# EAGLE schematic UI PCB - SCHEMATICS (EAGLE 9.7.0)

## Sheet 1 of 3
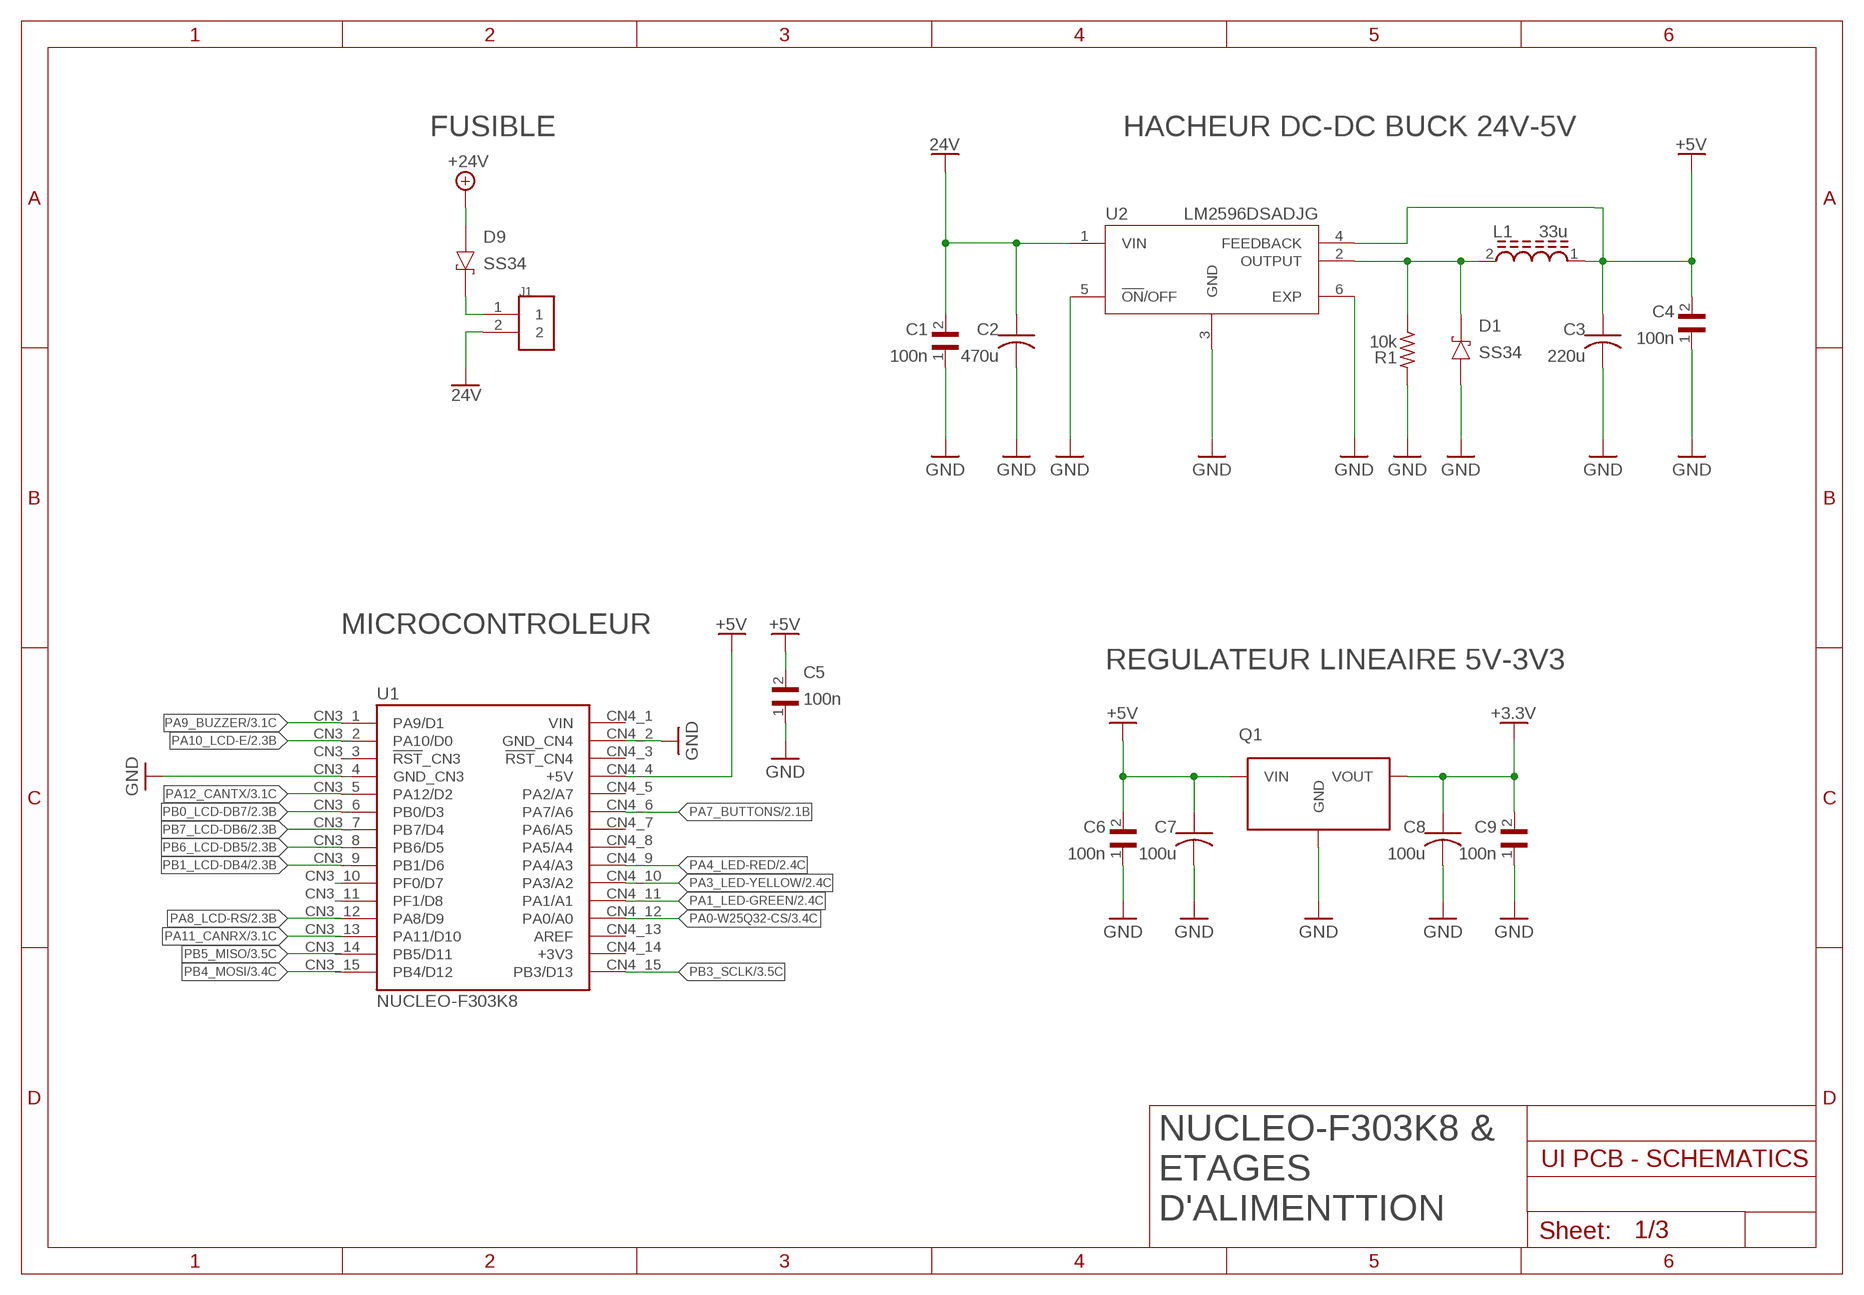
[diagram p0: schematic, sheet 1]

### Parts
C1  SR211C104KARTR1  [CAPRR508W50L508T317H508]
C2  ECA2CHG220  [CAPPRD500W60D1000H2000]
C3  EEUFC1E101SH  [CAPPRD250W50D630H1120]
C4  SR211C104KARTR1  [CAPRR508W50L508T317H508]
C5  SR211C104KARTR1  [CAPRR508W50L508T317H508]
C6  SR211C104KARTR1  [CAPRR508W50L508T317H508]
C7  ECEA1VKS470  [CAPPRD250W45D800H500]
C8  ECEA1VKS470  [CAPPRD250W45D800H500]
C9  SR211C104KARTR1  [CAPRR508W50L508T317H508]
D1  SS34  [DIO_SS34]
D9  SS34  [DIO_SS34]
J1  282837-2  [TE_282837-2]
L1  SRR1260-330M  [INDP125125X600N]
Q1  LD39150DT33-R  [DPAK]
R1  10k  R-US_0204/7  [0204/7]
U1  NUCLEO-F042K6  [MODULE_NUCLEO-F042K6]
U2  LM2596DSADJG  [CONV_LM2596DSADJG]

### Nets
24V: C1.2 C2.P J1.2 U2.1(VIN)
+3.3V: C8.P C9.2 Q1.3(VOUT) ; also sheet 2,3
+5V: C3.P C4.2 C5.2 C6.2 C7.P L1.1 Q1.1(VIN) U1.CN4_4(+5V) U2.4(FEEDBACK) ; also sheet 2,3
+24V: D9.A ; also sheet 3
GND: C1.1 C2.N C3.N C4.1 C5.1 C6.1 C7.N C8.N C9.1 D1.A Q1.2(GND) R1.2 U1.CN3_4(GND_CN3) U1.CN4_2(GND_CN4) U2.3(GND) U2.5(!ON!/OFF) U2.6(EXP) ; also sheet 2,3
N$2: D1.C(K) L1.2 R1.1 U2.2(OUTPUT)
N$13: D9.C(K) J1.1
PA0-W25Q32-CS: U1.CN4_12(PA0/A0) ; also sheet 3
PA1_LED-GREEN: U1.CN4_11(PA1/A1) ; also sheet 2
PA3_LED-YELLOW: U1.CN4_10(PA3/A2) ; also sheet 2
PA4_LED-RED: U1.CN4_9(PA4/A3) ; also sheet 2
PA7_BUTTONS: U1.CN4_6(PA7/A6) ; also sheet 2
PA8_LCD-RS: U1.CN3_12(PA8/D9) ; also sheet 2
PA9_BUZZER: U1.CN3_1(PA9/D1) ; also sheet 3
PA10_LCD-E: U1.CN3_2(PA10/D0) ; also sheet 2
PA11_CANRX: U1.CN3_13(PA11/D10) ; also sheet 3
PA12_CANTX: U1.CN3_5(PA12/D2) ; also sheet 3
PB0_LCD-DB7: U1.CN3_6(PB0/D3) ; also sheet 2
PB1_LCD-DB4: U1.CN3_9(PB1/D6) ; also sheet 2
PB3_SCLK: U1.CN4_15(PB3/D13) ; also sheet 3
PB4_MOSI: U1.CN3_15(PB4/D12) ; also sheet 3
PB5_MISO: U1.CN3_14(PB5/D11) ; also sheet 3
PB6_LCD-DB5: U1.CN3_8(PB6/D5) ; also sheet 2
PB7_LCD-DB6: U1.CN3_7(PB7/D4) ; also sheet 2
Unconnected: U1.CN3_3(!RST!_CN3) U1.CN3_10(PF0/D7) U1.CN3_11(PF1/D8) U1.CN4_3(!RST!_CN4) U1.CN4_5(PA2/A7) U1.CN4_7(PA6/A5) U1.CN4_8(PA5/A4) U1.CN4_13(AREF)

### Notes on the sheet
- FUSIBLE | HACHEUR DC-DC BUCK 24V-5V
- 33u
- 100n
- 100n | 470u | 220u
- MICROCONTROLEUR
- REGULATEUR LINEAIRE 5V-3V3
- 100n
- 100n | 100u | 100u | 100n
- NUCLEO-F303K8
- NUCLEO-F303K8 &
  ETAGES 
  D'ALIMENTTION

## Sheet 2 of 3
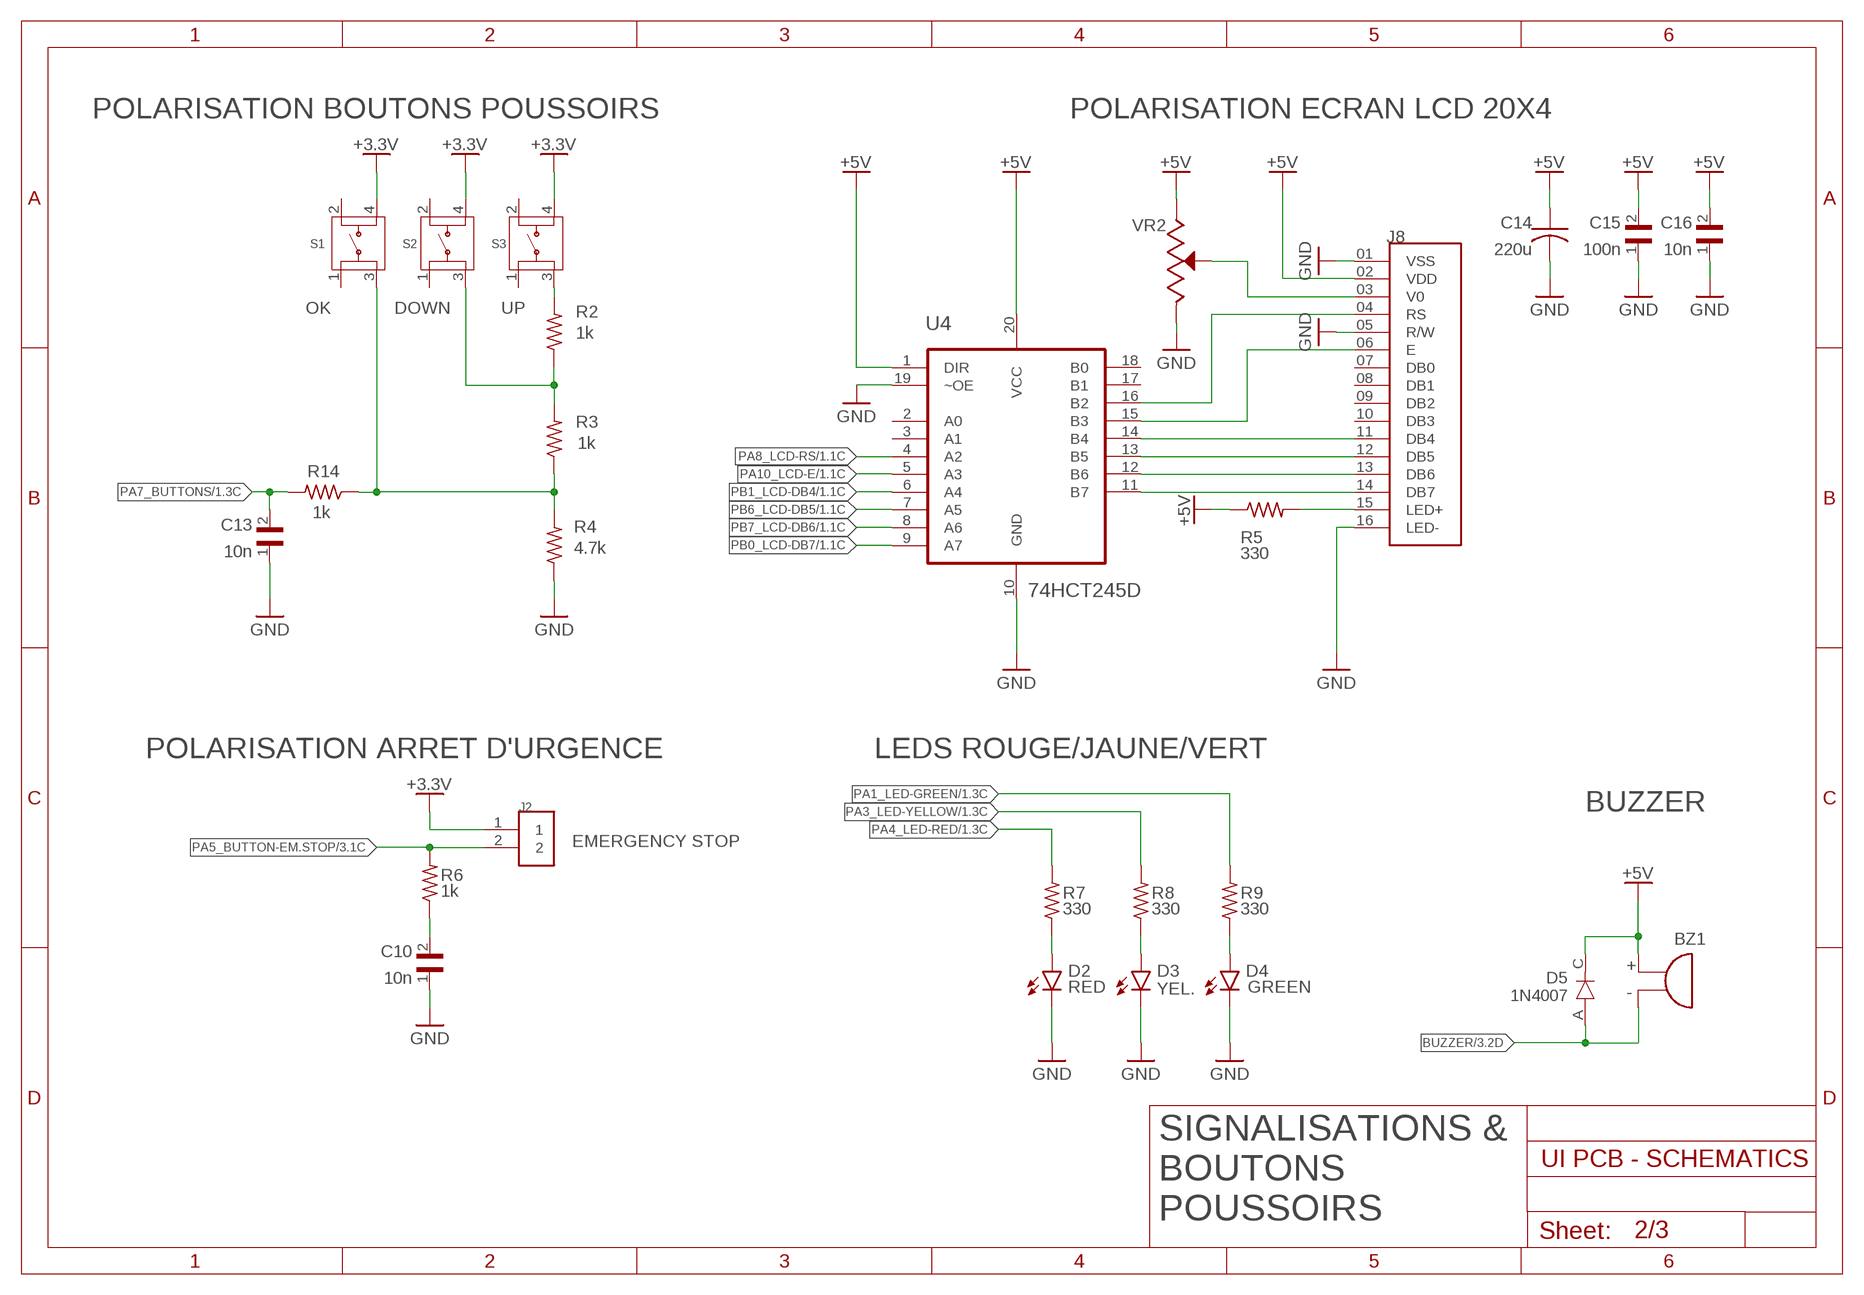
[diagram p1: schematic, sheet 2]

### Parts
BZ1  KSSG1201-16  [XDCR_KSSG1201-16]
C10  SR211C104KARTR1  [CAPRR508W50L508T317H508]
C13  SR211C104KARTR1  [CAPRR508W50L508T317H508]
C14  EEUFC1E101SH  [CAPPRD250W50D630H1120]
C15  SR211C104KARTR1  [CAPRR508W50L508T317H508]
C16  SR211C104KARTR1  [CAPRR508W50L508T317H508]
D2  LED_RADIALRED  [LEDRD254W60D565H860B_R]
D3  LED_RADIALYELLOW  [LEDRD254W60D565H860B_Y]
D4  LED_RADIALWHITE  [LEDRD254W60D565H860B_W]
D5  1N4007  [DIOAD1060W80L520D270]
J2  282837-2  [TE_282837-2]
J8  SSW-116-02-G-S-RA  [SAMTEC_SSW-116-02-G-S-RA]
R2  1k  R-US_0204/7  [0204/7]
R3  1k  R-US_0204/7  [0204/7]
R4  4.7k  R-US_0204/7  [0204/7]
R5  330  R-US_0204/7  [0204/7]
R6  1k  R-US_0204/7  [0204/7]
R7  330  R-US_0204/7  [0204/7]
R8  330  R-US_0204/7  [0204/7]
R9  330  R-US_0204/7  [0204/7]
R14  1k  R-US_0204/7  [0204/7]
S1  FSM8JH  [SW_FSM8JH]
S2  FSM8JH  [SW_FSM8JH]
S3  FSM8JH  [SW_FSM8JH]
U4  74HCT245D  [SOIC127P1032X265-20N]
VR2  3299Y-1-104LF  [3299Y1104LF]

### Nets
+3.3V: J2.1 S1.4 S2.4 S3.4 ; also sheet 1,3
+5V: BZ1.P(POS) C14.P C15.2 C16.2 D5.C J8.02(VDD) R5.1 U4.1(DIR) U4.20(VCC) VR2.1 ; also sheet 1,3
BUZZER: BZ1.N(NEG) D5.A ; also sheet 3
GND: C10.1 C13.1 C14.N C15.1 C16.1 D2.C D3.C D4.C J8.01(VSS) J8.05(R/W) J8.16(LED-) R4.1 U4.10(GND) VR2.3 ; also sheet 1,3
N$1: C10.2 R6.1
N$3: J8.14(DB7) U4.11(B7)
N$4: J8.13(DB6) U4.12(B6)
N$5: J8.12(DB5) U4.13(B5)
N$6: J8.11(DB4) U4.14(B4)
N$7: J8.06(E) U4.15(B3)
N$8: R2.2 S3.3
N$9: J8.04(RS) U4.16(B2)
N$10: R3.1 R4.2 R14.1 S1.3
N$12: R2.1 R3.2 S2.3
N$17: U4.19(~OE) ; supply symbol labelled GND
N$18: J8.03(V0) VR2.2
N$19: J8.15(LED+) R5.2
N$21: D2.A R7.1
N$22: D4.A R9.1
N$23: D3.A R8.1
PA1_LED-GREEN: R9.2 ; also sheet 1
PA3_LED-YELLOW: R8.2 ; also sheet 1
PA4_LED-RED: R7.2 ; also sheet 1
PA5_BUTTON-EM.STOP: J2.2 R6.2 ; also sheet 3
PA7_BUTTONS: C13.2 R14.2 ; also sheet 1
PA8_LCD-RS: U4.4(A2) ; also sheet 1
PA10_LCD-E: U4.5(A3) ; also sheet 1
PB0_LCD-DB7: U4.9(A7) ; also sheet 1
PB1_LCD-DB4: U4.6(A4) ; also sheet 1
PB6_LCD-DB5: U4.7(A5) ; also sheet 1
PB7_LCD-DB6: U4.8(A6) ; also sheet 1
Unconnected: J8.07(DB0) J8.08(DB1) J8.09(DB2) J8.10(DB3) S1.1 S1.2 S2.1 S2.2 S3.1 S3.2 U4.2(A0) U4.3(A1) U4.17(B1) U4.18(B0)

### Notes on the sheet
- POLARISATION BOUTONS POUSSOIRS | POLARISATION ECRAN LCD 20X4
- 220u | 100n | 10n
- OK | DOWN | UP
- 10n
- POLARISATION ARRET D'URGENCE | LEDS ROUGE/JAUNE/VERT
- BUZZER
- EMERGENCY STOP
- 10n
- RED | YEL. | GREEN
- SIGNALISATIONS & 
  BOUTONS 
  POUSSOIRS

## Sheet 3 of 3
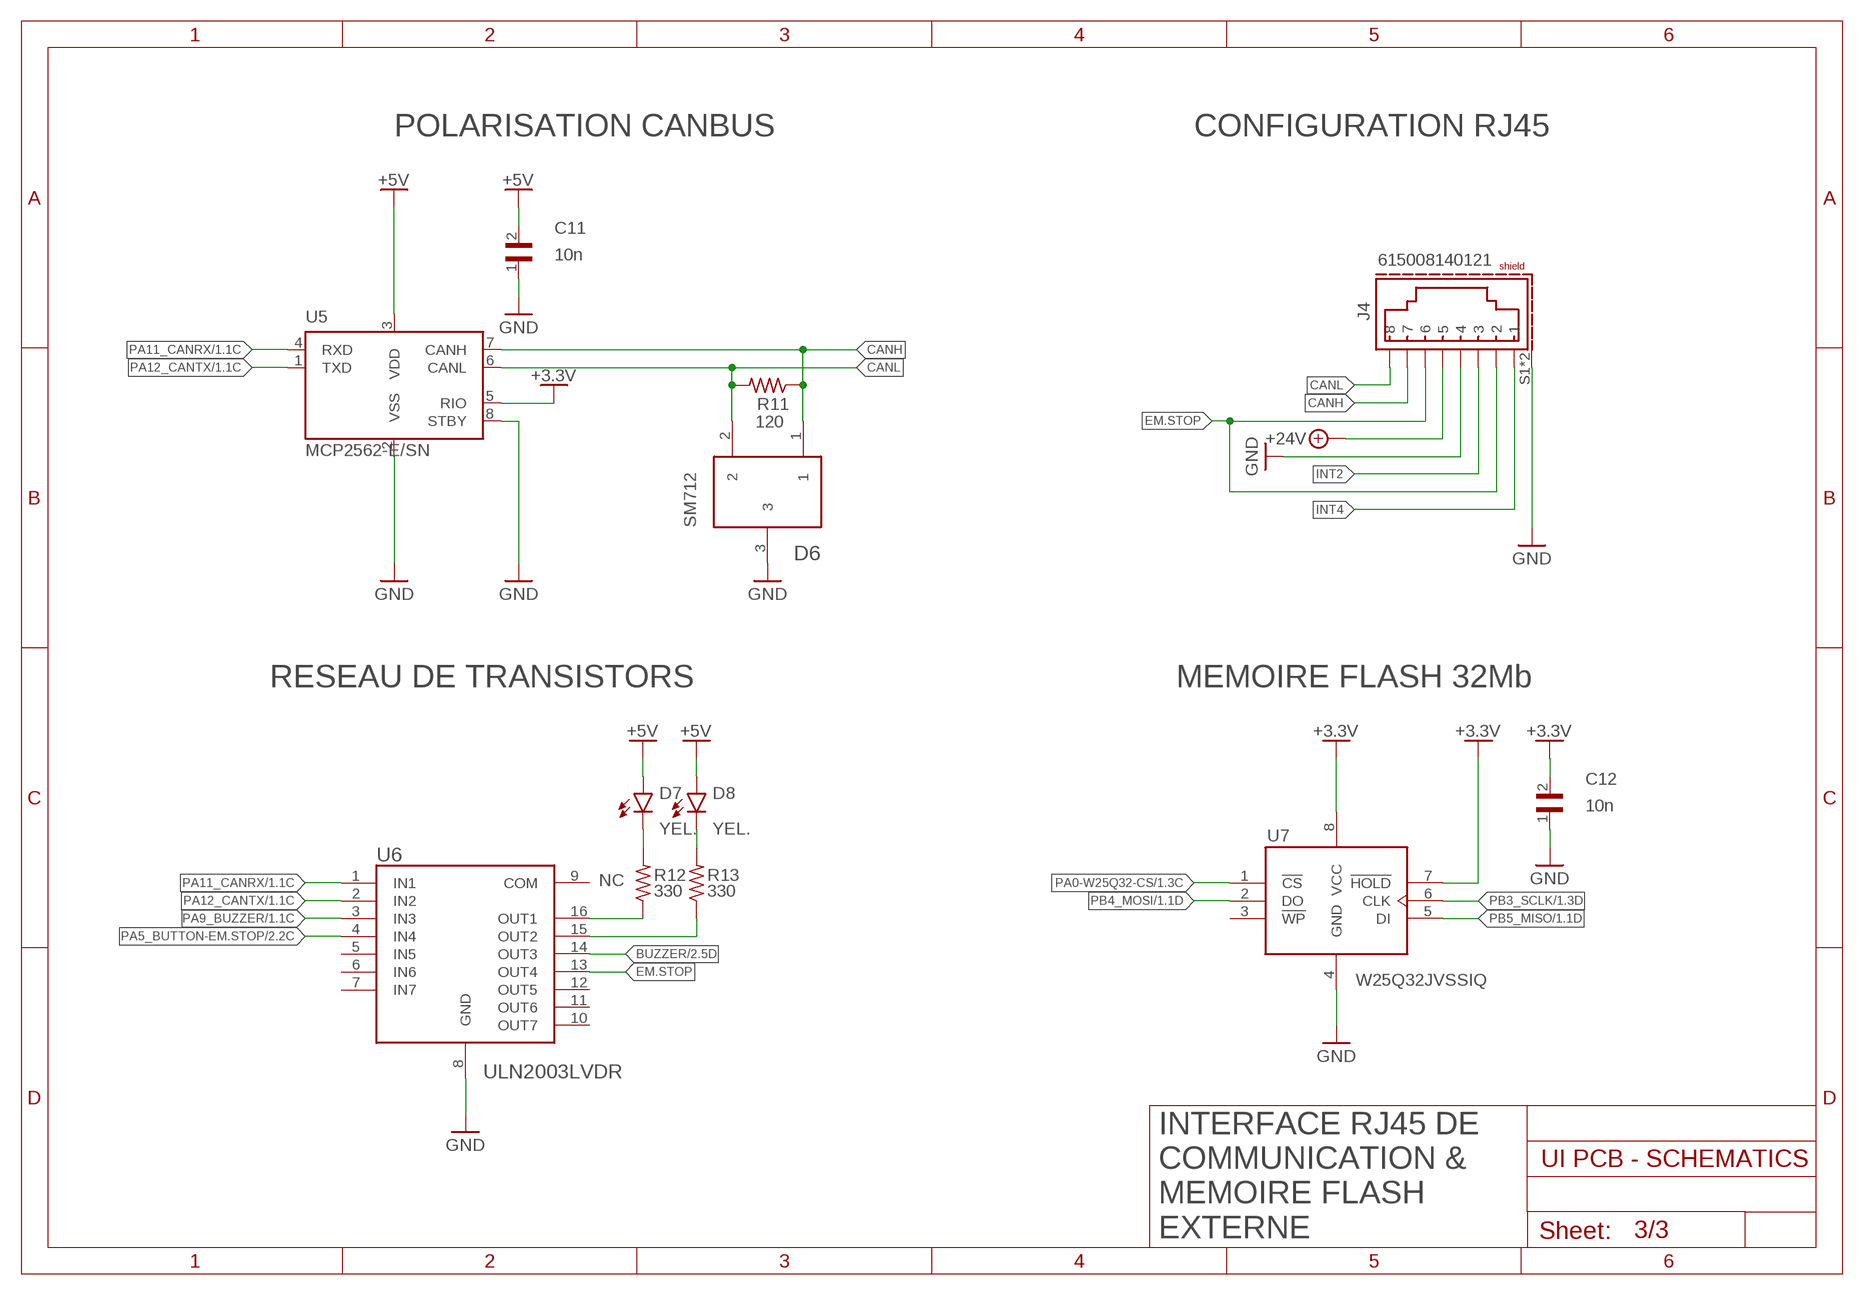
[diagram p2: schematic, sheet 3]

### Parts
C11  SR211C104KARTR1  [CAPRR508W50L508T317H508]
C12  SR211C104KARTR1  [CAPRR508W50L508T317H508]
D6  SM712.TCT  [SOT23]
D7  LED_RADIALYELLOW  [LEDRD254W60D565H860B_Y]
D8  LED_RADIALYELLOW  [LEDRD254W60D565H860B_Y]
J4  615008140121  [615008140121]
R11  120  R-US_0204/7  [0204/7]
R12  330  R-US_0204/7  [0204/7]
R13  330  R-US_0204/7  [0204/7]
U5  MCP2562-E/SN  [SOIC127P600X175-8N]
U6  ULN2003LVDR  [SOIC127P600X175-16N]
U7  W25Q32JVSSIQ  [SOIC127P790X216-8N]

### Nets
+3.3V: C12.2 U5.5(RIO) U7.7(!HOLD!) U7.8(VCC) ; also sheet 1,2
+5V: C11.2 D7.A D8.A U5.3(VDD) ; also sheet 1,2
+24V: J4.5 ; also sheet 1
BUZZER: U6.14(OUT3) ; also sheet 2
CANH: D6.1 J4.7 R11.1 U5.7(CANH)
CANL: D6.2 J4.8 R11.2 U5.6(CANL)
EM.STOP: J4.2 J4.6 U6.13(OUT4)
GND: C11.1 C12.1 D6.3 J4.4 J4.S1(SHIELD) J4.S2(SHIELD) U5.2(VSS) U5.8(STBY) U6.8(GND) U7.4(GND) ; also sheet 1,2
INT2: J4.3
INT4: J4.1
N$20: R13.1 U6.15(OUT2)
N$34: R12.1 U6.16(OUT1)
N$36: D7.C R12.2
N$37: D8.C R13.2
PA0-W25Q32-CS: U7.1(!CS) ; also sheet 1
PA5_BUTTON-EM.STOP: U6.4(IN4) ; also sheet 2
PA9_BUZZER: U6.3(IN3) ; also sheet 1
PA11_CANRX: U5.4(RXD) U6.1(IN1) ; also sheet 1
PA12_CANTX: U5.1(TXD) U6.2(IN2) ; also sheet 1
PB3_SCLK: U7.6(CLK) ; also sheet 1
PB4_MOSI: U7.2(DO) ; also sheet 1
PB5_MISO: U7.5(DI) ; also sheet 1
Unconnected: U6.5(IN5) U6.6(IN6) U6.7(IN7) U6.9(COM) U6.10(OUT7) U6.11(OUT6) U6.12(OUT5) U7.3(!WP!)

### Notes on the sheet
- POLARISATION CANBUS | CONFIGURATION RJ45
- 10n
- RESEAU DE TRANSISTORS | MEMOIRE FLASH 32Mb
- 10n
- YEL. | YEL.
- NC
- INTERFACE RJ45 DE 
  COMMUNICATION & 
  MEMOIRE FLASH 
  EXTERNE

## Power pins joined to a net without a drawn wire
+3V3: U1.CN4_14(+3V3)
VIN: U1.CN4_1(VIN)

## Library data of the parts
BZ1 = Buzzer:KSSG1201-16: Check availability <https://pricing.snapeda.com/parts/KSSG1201-16/Kingstate/view-part?ref=eda>; AVAILABILITY: In Stock; CHECK_PRICES: https://www.snapeda.com/parts/KSSG1201-16/Kingstate/view-part/?ref=eda; DESCRIPTION: MAGNETIC TRANSDUCER, PCB; Transducer Function:Buzzer; Supply Voltage Min:1V; Supply Voltage Max:-; Current Rating:35mA; Tones:-; Sound Level SPL:85dB; Resonant Frequency:2kHz; Transducer Mounting:-; Product Range:-; SVHC:No SVHC RoHS Compliant: Yes; MF: Kingstate; MP: KSSG1201-16; PACKAGE: None; PRICE: None; SNAPEDA_LINK: https://www.snapeda.com/parts/KSSG1201-16/Kingstate/view-part/?ref=snap
C1 C4-C6 C9-C13 C15 C16 = 100nF:SR211C104KARTR1: Check availability <https://pricing.snapeda.com/parts/SR211C104KARTR1/AVX/view-part?ref=eda>; AVAILABILITY: In Stock; CHECK_PRICES: https://www.snapeda.com/parts/SR211C104KARTR1/AVX/view-part/?ref=eda; DESCRIPTION: 0.1 µF ±10% 100V Ceramic Capacitor X7R Radial; MF: AVX; MP: SR211C104KARTR1; PACKAGE: Radial AVX Interconnect / Elco; PRICE: None; SNAPEDA_LINK: https://www.snapeda.com/parts/SR211C104KARTR1/AVX/view-part/?ref=snap
C2 = 680uF 35V:ECA2CHG220: Check availability <https://pricing.snapeda.com/parts/ECA2CHG220/Panasonic/view-part?ref=eda>; AVAILABILITY: In Stock; CHECK_PRICES: https://www.snapeda.com/parts/ECA2CHG220/Panasonic/view-part/?ref=eda; DESCRIPTION: Capacitor; Alum Electrolytic; Cap 22 uF; Tol 20%; Vol-Rtg 160 VDC; Radial; 10x20; Bulk; MF: Panasonic; MP: ECA2CHG220; PACKAGE: RADIAL-2 Panasonic; PRICE: None; SNAPEDA_LINK: https://www.snapeda.com/parts/ECA2CHG220/Panasonic/view-part/?ref=snap
C3 C14 = 220uF 10V:EEUFC1E101SH: Check availability <https://pricing.snapeda.com/parts/EEU-FC1E101SH/Panasonic/view-part?ref=eda>; AVAILABILITY: In Stock; CHECK_PRICES: https://www.snapeda.com/parts/EEU-FC1E101SH/Panasonic/view-part/?ref=eda; DESCRIPTION: Capacitor,Alum Lytic,Cap 100 uF,Tol 20%,Vol-Rtg 25 VDC,Radial,6.3x11,Tape&Box | Panasonic Electronic Components EEU-FC1E101SH; MF: Panasonic; MP: EEU-FC1E101SH; PACKAGE: RADIAL-2 Panasonic; PRICE: None; SNAPEDA_LINK: https://www.snapeda.com/parts/EEU-FC1E101SH/Panasonic/view-part/?ref=snap
C7 C8 = 100uF 25V:ECEA1VKS470: Check availability <https://pricing.snapeda.com/parts/ECE-A1VKS470/Panasonic/view-part?ref=eda>; AVAILABILITY: In Stock; CHECK_PRICES: https://www.snapeda.com/parts/ECE-A1VKS470/Panasonic/view-part/?ref=eda; DESCRIPTION: Capacitor,Alum Electrolytic,Cap 47 uF,Tol 20%,Vol-Rtg 35 VDC,Radial,8x5,Bulk | Panasonic Electronic Components ECE-A1VKS470; MF: Panasonic; MP: ECE-A1VKS470; PACKAGE: RADIAL-2 Panasonic; PRICE: None; SNAPEDA_LINK: https://www.snapeda.com/parts/ECE-A1VKS470/Panasonic/view-part/?ref=snap
D1 D9 = SS34:SS34: Check availability <https://pricing.snapeda.com/parts/SS34/Taiwan%20Semiconductor/view-part?ref=eda>; AVAILABILITY: In Stock; CHECK_PRICES: https://www.snapeda.com/parts/SS34/taiwan/view-part/?ref=eda; DESCRIPTION: 3A, 40V, Schottky Rectifier; MF: Taiwan Semiconductor; MP: SS34; PACKAGE: DO-214AB-2 Taiwan Semiconductor; PRICE: None; SNAPEDA_LINK: https://www.snapeda.com/parts/SS34/taiwan/view-part/?ref=snap
D2-D4 D7 D8 = LED:LED_RADIAL: LED - Generic
D5 = 1N4007:1N4007: Check availability <https://pricing.snapeda.com/parts/1N4007/Diotec%20Semiconductor/view-part?ref=eda>; AVAILABILITY: In Stock; CHECK_PRICES: https://www.snapeda.com/parts/1N4007/Diotec/view-part/?ref=eda; DESCRIPTION: Diode, DO-41, 1000V, 1A, 175°C; MF: Diotec Semiconductor; MP: 1N4007; PACKAGE: DO-41 Diotec; PRICE: None; SNAPEDA_LINK: https://www.snapeda.com/parts/1N4007/Diotec/view-part/?ref=snap
D6 = SM712:SM712.TCT: Check availability <https://pricing.snapeda.com/parts/SM712.TCT/Semtech%20Corporation/view-part?ref=eda>; AVAILABILITY: In Stock; CHECK_PRICES: https://www.snapeda.com/parts/SM712.TCT/Semtech/view-part/?ref=eda; DESCRIPTION: SM Series 12 V 400 W Asymmetrical TVS Diode for Extended Common-Mode - SOT-23; MF: Semtech Corporation; MP: SM712.TCT; PACKAGE: SOT-23 Semtech; PRICE: None; SNAPEDA_LINK: https://www.snapeda.com/parts/SM712.TCT/Semtech/view-part/?ref=snap
J1 J2 = 282837-2:282837-2: Check availability <https://pricing.snapeda.com/parts/282837-2/TE%20Connectivity/view-part?ref=eda>; AVAILABILITY: In Stock; CHECK_PRICES: https://www.snapeda.com/parts/282837-2/TE+Connectivity+AMP+Connectors/view-part/?ref=eda; COMMENT: 282837-2; DESCRIPTION: Terminal Block Connector Wire Receptacle 2 5.08 mm 30-16 AWG Green 13.5 A 250 V | TE Connectivity 282837-2; MF: TE Connectivity; MP: 282837-2; PACKAGE: None; PRICE: None; SNAPEDA_LINK: https://www.snapeda.com/parts/282837-2/TE+Connectivity+AMP+Connectors/view-part/?ref=snap
J4 = Ethernet connector:615008140121: Check availability <https://pricing.snapeda.com/parts/615008140121/Wurth%20Elektronik/view-part?ref=eda>; AVAILABILITY: In Stock; CHECK_PRICES: https://www.snapeda.com/parts/615008140121/Wurth+Electronics/view-part/?ref=eda; DESCRIPTION: ModularJack_8P8C_THT_Horizontal_Shielded_Tab Down; MF: Wurth Elektronik; MP: 615008140121; PACKAGE: None; PRICE: None; SNAPEDA_LINK: https://www.snapeda.com/parts/615008140121/Wurth+Electronics/view-part/?ref=snap
J8 = Header 16 positions right angle:SSW-116-02-G-S-RA: Check availability <https://pricing.snapeda.com/parts/SSW-116-02-G-S-RA/Samtec%20Inc./view-part?ref=eda>; AVAILABILITY: In Stock; CHECK_PRICES: https://www.snapeda.com/parts/SSW-116-02-G-S-RA/Samtec+Inc./view-part/?ref=eda; DESCRIPTION: 16 Position Receptacle Connector 0.100 (2.54mm) Through Hole, Right Angle Gold; MF: Samtec Inc.; MP: SSW-116-02-G-S-RA; PACKAGE: None; PRICE: None; SNAPEDA_LINK: https://www.snapeda.com/parts/SSW-116-02-G-S-RA/Samtec+Inc./view-part/?ref=snap
L1 = 33uH 3A:SRR1260-330M: Check availability <https://pricing.snapeda.com/parts/SRR1260-330M/Bourns%20-%20J.W.%20Miller/view-part?ref=eda>; AVAILABILITY: In Stock; CHECK_PRICES: https://www.snapeda.com/parts/SRR1260-330M/Bourns/view-part/?ref=eda; DESCRIPTION: 33 µH Shielded Drum Core, Wirewound Inductor 3 A 60mOhm Max Nonstandard; MF: Bourns - J.W. Miller; MP: SRR1260-330M; PACKAGE: Nonstandard Bourns - J.W. Miller; PRICE: None; SNAPEDA_LINK: https://www.snapeda.com/parts/SRR1260-330M/Bourns/view-part/?ref=snap
Q1 = 3V3 regulator:LD39150DT33-R: Check availability <https://pricing.snapeda.com/parts/IPB60R165CP/Infineon/view-part?ref=eda>; AVAILABILITY: In Stock; CHECK_PRICES: https://www.snapeda.com/parts/IPB60R165CP/Infineon/view-part/?ref=eda; DESCRIPTION: N-Channel 600 V 21A (Tc) 192W (Tc) Surface Mount PG-TO263-3-2; MF: Infineon; MP: IPB60R165CP; PACKAGE: TO-263 Infineon; PRICE: None; SNAPEDA_LINK: https://www.snapeda.com/parts/IPB60R165CP/Infineon/view-part/?ref=snap
R1-R9 R11-R14 = rcl:R-US_: RESISTOR, American symbol; SPICEPREFIX: R
S1-S3 = Button:FSM8JH: Check availability <https://pricing.snapeda.com/parts/FSM8JH/TE%20Connectivity/view-part?ref=eda>; AVAILABILITY: In Stock; CHECK_PRICES: https://www.snapeda.com/parts/FSM8JH/TE+Connectivity+ALCOSWITCH+Switches/view-part/?ref=eda; DESCRIPTION: Switch,Pushbutton,Tactile,SPST,Thru Hole,Vertical,6MM,Black | TE Connectivity FSM8JH; MF: TE Connectivity; MP: FSM8JH; PACKAGE: None; PRICE: None; SNAPEDA_LINK: https://www.snapeda.com/parts/FSM8JH/TE+Connectivity+ALCOSWITCH+Switches/view-part/?ref=snap
U1 = NUCLEO-F303K8:NUCLEO-F042K6: Check availability <https://pricing.snapeda.com/parts/NUCLEO-F042K6/STMicroelectronics/view-part?ref=eda>; AVAILABILITY: In Stock; CHECK_PRICES: https://www.snapeda.com/parts/NUCLEO-F042K6/STMicroelectronics/view-part/?ref=eda; DESCRIPTION: STM32F042K6, mbed-Enabled Development Nucleo-32 STM32F0 ARM® Cortex®-M0 MCU 32-Bit Embedded Evaluation Board; MF: STMicroelectronics; MP: NUCLEO-F042K6; PACKAGE: None; PRICE: None; SNAPEDA_LINK: https://www.snapeda.com/parts/NUCLEO-F042K6/STMicroelectronics/view-part/?ref=snap
U2 = LM2596:LM2596DSADJG: Check availability <https://pricing.snapeda.com/parts/LM2596DSADJG/ON%20Semiconductor/view-part?ref=eda>; AVAILABILITY: In Stock; CHECK_PRICES: https://www.snapeda.com/parts/LM2596DSADJG/Onsemi/view-part/?ref=eda; DESCRIPTION: LM2596DSADJG Switching Regulator 3A Adjustable, 1.23 to 37 V, 5-Pin D2PAK | ON Semiconductor LM2596DSADJG; MF: ON Semiconductor; MP: LM2596DSADJG; PACKAGE: D2PAK-5 ON Semiconductor; PRICE: None; SNAPEDA_LINK: https://www.snapeda.com/parts/LM2596DSADJG/Onsemi/view-part/?ref=snap
U4 = 74HCT245D:74HCT245D: Check availability <https://pricing.snapeda.com/parts/74HCT245D/Toshiba/view-part?ref=eda>; AVAILABILITY: In Stock; CHECK_PRICES: https://www.snapeda.com/parts/74HCT245D/Toshiba/view-part/?ref=eda; DESCRIPTION: Transceiver, Non-Inverting 1 Element 8 Bit per Element 3-State Output 20-SOIC; MF: Toshiba; MP: 74HCT245D; PACKAGE: SO-20 NXP Semiconductors; PRICE: None; SNAPEDA_LINK: https://www.snapeda.com/parts/74HCT245D/Toshiba/view-part/?ref=snap
U5 = MCP2562:MCP2562-E/SN: Check availability <https://pricing.snapeda.com/parts/MCP2562-E/SN/Microchip/view-part?ref=eda>; AVAILABILITY: In Stock; CHECK_PRICES: https://www.snapeda.com/parts/MCP2562-E/SN/Microchip/view-part/?ref=eda; DESCRIPTION: Microchip MCP2562-E/SN,CAN Transceiver 1MBps 1-channel IEC 61000-4-2,8-Pin SOIC | Microchip Technology Inc. MCP2562-E/SN; MF: Microchip; MP: MCP2562-E/SN; PACKAGE: SO-8 Microchip; PRICE: None; SNAPEDA_LINK: https://www.snapeda.com/parts/MCP2562-E/SN/Microchip/view-part/?ref=snap
U6 = ULN2003:ULN2003LVDR: Check availability <https://pricing.snapeda.com/parts/ULN2003LVDR/Texas%20Instruments/view-part?ref=eda>; AVAILABILITY: In Stock; CHECK_PRICES: https://www.snapeda.com/parts/ULN2003LVDR/Texas+Instruments/view-part/?ref=eda; DESCRIPTION: 50-V, 7-ch NMOS array low-side driver; MF: Texas Instruments; MP: ULN2003LVDR; PACKAGE: SOIC-16 Texas Instruments; PRICE: None; SNAPEDA_LINK: https://www.snapeda.com/parts/ULN2003LVDR/Texas+Instruments/view-part/?ref=snap
U7 = W25Q32:W25Q32JVSSIQ: Check availability <https://pricing.snapeda.com/parts/W25Q32JVSSIQ/Winbond/view-part?ref=eda>; AVAILABILITY: In Stock; CHECK_PRICES: https://www.snapeda.com/parts/W25Q32JVSSIQ/Winbond/view-part/?ref=eda; DESCRIPTION: FLASH - NOR Memory IC 32Mb (4M x 8) SPI - Quad I/O 133 MHz 8-SOIC; MF: Winbond; MP: W25Q32JVSSIQ; PACKAGE: SOIC-8 Winbond; PRICE: None; SNAPEDA_LINK: https://www.snapeda.com/parts/W25Q32JVSSIQ/Winbond/view-part/?ref=snap
VR2 = Trimmer 10k:3299Y-1-104LF: Check availability <https://pricing.snapeda.com/parts/3299Y-1-104LF/Bourns/view-part?ref=eda>; AVAILABILITY: In Stock; CHECK_PRICES: https://www.snapeda.com/parts/3299Y-1-104LF/Bourns/view-part/?ref=eda; DESCRIPTION: Trimmer, Cermet, Rest 100 Kilohms, PCB, 25 Turns, Pwr-Rtg 0.5W | Bourns 3299Y-1-104LF; MF: Bourns; MP: 3299Y-1-104LF; PACKAGE: DIP-3 Bourns; PRICE: None; SNAPEDA_LINK: https://www.snapeda.com/parts/3299Y-1-104LF/Bourns/view-part/?ref=snap